# Altium schematic sheet MCU.SchDoc
size 320 x 193 mm
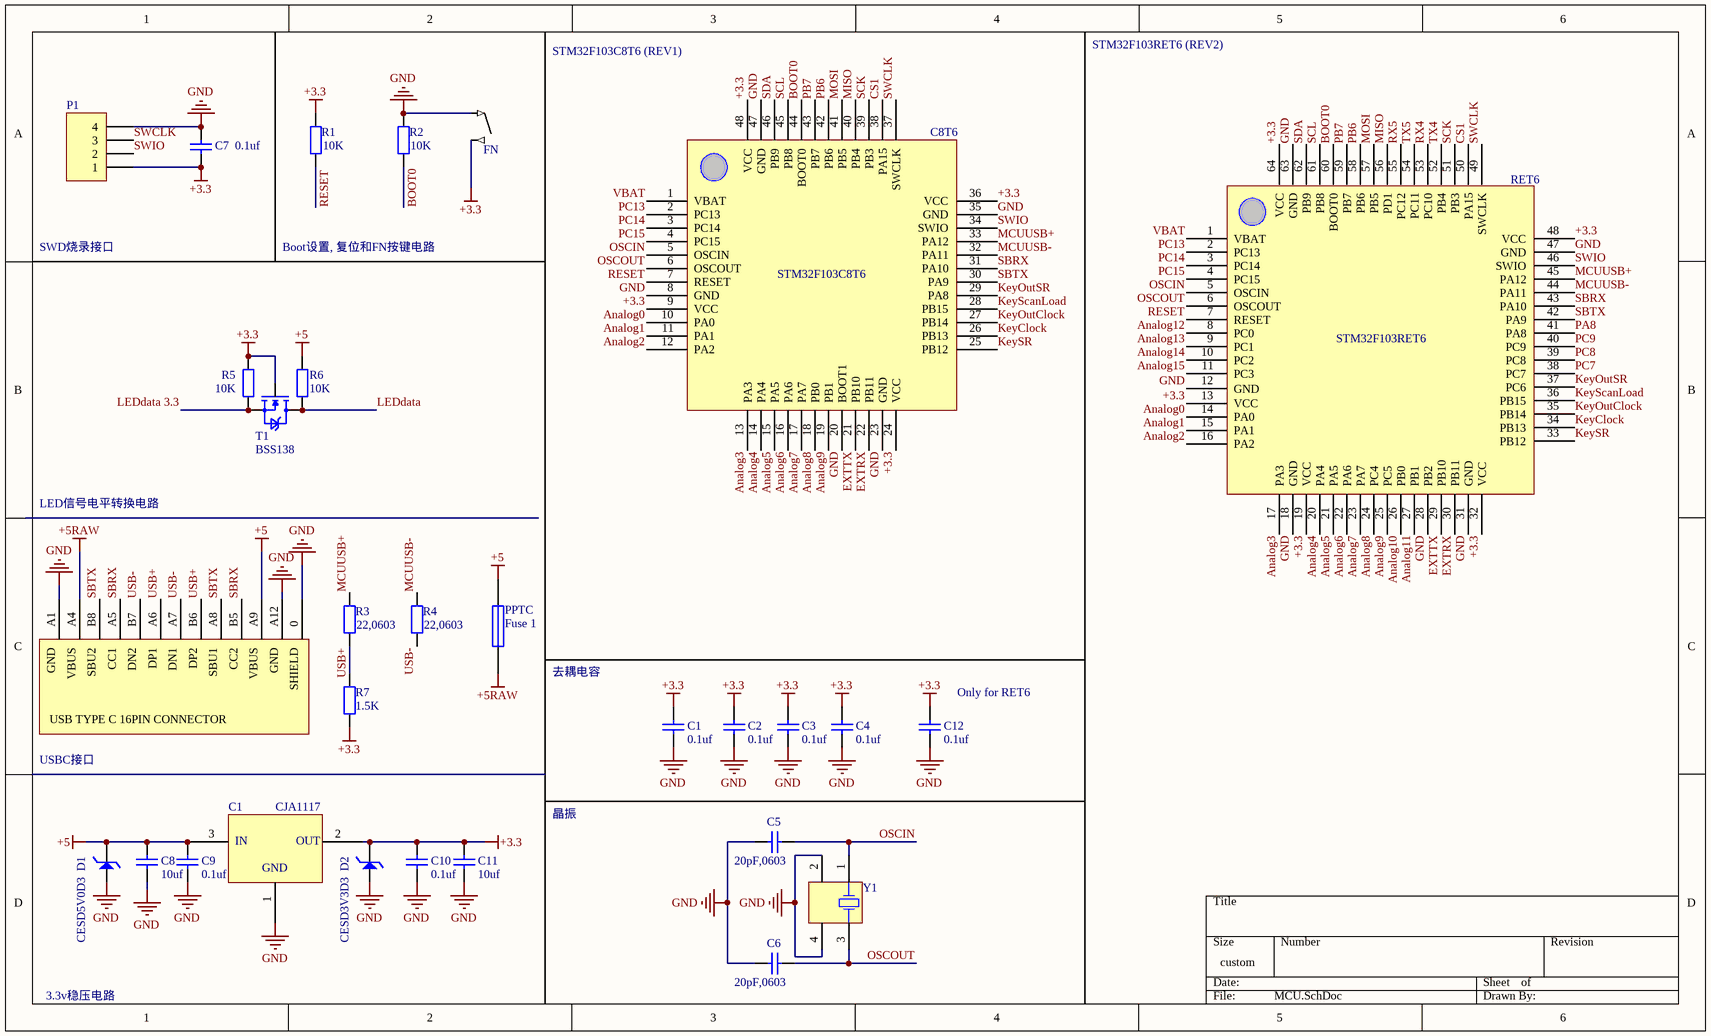
[diagram p0: MCU.SchDoc]

## Parts
(Parts that share a designator on the sheet are numbered #1, #2 ... from top to bottom, then left to right.)
1  System  [USBC 16PIN -1.6]  (value not drawn)
C1#1  value 0.1uf  [C1206]  (hidden comment: System)
C1#2  CJA1117  [SOT89-3L]
C2  value 0.1uf  [C1206]  (hidden comment: System)
C3  value 0.1uf  [C1206]  (hidden comment: System)
C4  value 0.1uf  [C1206]  (hidden comment: System)
C5  value 20pF,0603  [1608[0603]]  (hidden comment: System)
C6  value 20pF,0603  [1608[0603]]  (hidden comment: System)
C7  value 0.1uf  [C1206]  (hidden comment: System)
C8  value 10uf  [C1206]  (hidden comment: System)
C8T6  System  [STM-LQFP48_L]  (value not drawn)
C9  value 0.1uf  [C1206]  (hidden comment: System)
C10  value 0.1uf  [C1206]  (hidden comment: System)
C11  value 10uf  [C1206]  (hidden comment: System)
C12  value 0.1uf  [C1206]  (hidden comment: System)
D1  CESD5V0D3  [SOD323]
D2  CESD3V3D3  [SOD323]
FN  System  [dome button]  (value not drawn)
P1  System  [HDR1X4]  (value not drawn)
PPTC  Fuse 1  [C1206]
R1  value 10K  [C1206]  (hidden comment: System)
R2  value 10K  [C1206]  (hidden comment: System)
R3  value 22,0603  [1608[0603]]  (hidden comment: System)
R4  value 22,0603  [1608[0603]]  (hidden comment: System)
R5  value 10K  [C1206]  (hidden comment: System)
R6  value 10K  [C1206]  (hidden comment: System)
R7  value 1.5K  [C1206]  (hidden comment: System)
RET6  RET6  [STM-LQFP64_L]  (value not drawn)
T1  BSS138  [SOT23]
Y1  System  [3225]  (value not drawn)

## Nets
+3.3: C1#1.2 C1#2.2 C2.2 C3.2 C4.2 C7.1 C8T6.9(VCC) C8T6.24(VCC) C8T6.36(VCC) C8T6.48(VCC) C10.2 C11.2 C12.2 D2.2 FN.2(Out) P1.1 R1.2 R5.2 R7.2 RET6.13(VCC) RET6.19(VCC) RET6.32(VCC) RET6.48(VCC) RET6.64(VCC) T1.1
+5: 1.A9 C1#2.3 C8.2 C9.2 D1.2 PPTC.2 R6.2
+5RAW: 1.A4 PPTC.1
GND: 1.0 1.A1 1.A12 C1#1.1 C1#2.1 C2.1 C3.1 C4.1 C5.1 C6.1 C7.2 C8.1 C8T6.8(GND) C8T6.20(BOOT1) C8T6.23(GND) C8T6.35(GND) C8T6.47(GND) C9.1 C10.1 C11.1 C12.1 FN.1 P1.4 R2.2 RET6.12(GND) RET6.18(GND) RET6.28(PB2) RET6.31(GND) RET6.47(GND) RET6.63(GND) Y1.2(NC) Y1.4(NC)
Analog0: C8T6.10(PA0) RET6.14(PA0)
Analog1: C8T6.11(PA1) RET6.15(PA1)
Analog2: C8T6.12(PA2) RET6.16(PA2)
Analog3: C8T6.13(PA3) RET6.17(PA3)
Analog4: C8T6.14(PA4) RET6.20(PA4)
Analog5: C8T6.15(PA5) RET6.21(PA5)
Analog6: C8T6.16(PA6) RET6.22(PA6)
Analog7: C8T6.17(PA7) RET6.23(PA7)
Analog8: C8T6.18(PB0) RET6.24(PC4)
Analog9: C8T6.19(PB1) RET6.25(PC5)
Analog10: RET6.26(PB0)
Analog11: RET6.27(PB1)
Analog12: RET6.8(PC0)
Analog13: RET6.9(PC1)
Analog14: RET6.10(PC2)
Analog15: RET6.11(PC3)
BOOT0: C8T6.44(BOOT0) R2.1 RET6.60(BOOT0)
CS1: C8T6.38(PA15) RET6.50(PA15)
EXTRX: C8T6.22(PB11) RET6.30(PB11)
EXTTX: C8T6.21(PB10) RET6.29(PB10)
KeyClock: C8T6.26(PB13) RET6.34(PB13)
KeyOutClock: C8T6.27(PB14) RET6.35(PB14)
KeyOutSR: C8T6.29(PA8) RET6.37(PC6)
KeyScanLoad: C8T6.28(PB15) RET6.36(PB15)
KeySR: C8T6.25(PB12) RET6.33(PB12)
LEDdata: R6.1 T1.3
LEDdata 3.3: R5.1 T1.2
MCUUSB+: C8T6.33(PA12) R3.2 RET6.45(PA12)
MCUUSB-: C8T6.32(PA11) R4.2 RET6.44(PA11)
MISO: C8T6.40(PB4) RET6.56(PD1)
MOSI: C8T6.41(PB5) RET6.57(PB5)
OSCIN: C5.2 C8T6.5(OSCIN) RET6.5(OSCIN) Y1.1(OSC1)
OSCOUT: C6.2 C8T6.6(OSCOUT) RET6.6(OSCOUT) Y1.3(OSC2)
PA8: RET6.41(PA8)
PB6: C8T6.42(PB6) RET6.58(PB6)
PB7: C8T6.43(PB7) RET6.59(PB7)
PC7: RET6.38(PC7)
PC8: RET6.39(PC8)
PC9: RET6.40(PC9)
PC13: C8T6.2(PC13) RET6.2(PC13)
PC14: C8T6.3(PC14) RET6.3(PC14)
PC15: C8T6.4(PC15) RET6.4(PC15)
RESET: C8T6.7(RESET) R1.1 RET6.7(RESET)
RX4: RET6.53(PC10)
RX5: RET6.55(PC12)
SBRX: 1.A5 1.B5 C8T6.31(PA10) RET6.43(PA10)
SBTX: 1.A8 1.B8 C8T6.30(PA9) RET6.42(PA9)
SCK: C8T6.39(PB3) RET6.51(PB3)
SCL: C8T6.45(PB8) RET6.61(PB8)
SDA: C8T6.46(PB9) RET6.62(PB9)
SWCLK: C8T6.37(SWCLK) P1.3 RET6.49(SWCLK)
SWIO: C8T6.34(SWIO) P1.2 RET6.46(SWIO)
TX4: RET6.52(PB4)
TX5: RET6.54(PC11)
USB+: 1.A6 1.B6 R3.1 R7.1
USB-: 1.A7 1.B7 R4.1
VBAT: C8T6.1(VBAT) RET6.1(VBAT)

Not connected (* = marked no-connect by the designer): D1 1; D2 1

## Notes on the sheet
- STM32F103C8T6 (REV1)
- STM32F103RET6 (REV2)
- SWD烧录接口
- Boot设置, 复位和FN按键电路
- LED信号电平转换电路
- 去耦电容
- (near C12) Only for RET6
- USBC接口
- 晶振
- 3.3v稳压电路
- Labels drawn without touching a wire or pin: GND
- (in symbol C8T6) STM32F103C8T6
- (in symbol CJA1117) IN; OUT; GND
- (in symbol RET6) STM32F103RET6
- (in symbol USBC 16PIN) GND; VBUS; SBU2; CC1; DN2; DP1; DN1; DP2; SBU1; CC2; SHIELD; USB TYPE C 16PIN CONNECTOR

## Library data of the parts
1 = USBC 16PIN
C1#1 C2-C12 = Cap: Published: 8-Jun-2000; LatestRevisionDate: 17-Jul-2002; LatestRevisionNote: Re-released for DXP Platform.; PackageReference: RAD-0.3; Publisher: Altium Limited; PackageDescription: Radial Cap, Thru-Hole; 2 Leads; 0.3 in Pin Spacing
C8T6 = C8T6
D1 D2 = TVS
FN = SW
P1 = Header 4: LatestRevisionDate: 17-Jul-2002; LatestRevisionNote: Re-released for DXP Platform.; Publisher: Altium Limited
PPTC = Fuse 1: Fuse; Published: 8-Jun-2000; LatestRevisionDate: 17-Jul-2002; LatestRevisionNote: Re-released for DXP Platform.; PackageReference: PIN-W2/E2.8; Publisher: Altium Limited; PackageDescription: Thru-Hole; 2 Leads
R1-R7 = Res2: Published: 8-Jun-2000; LatestRevisionDate: 17-Jul-2002; LatestRevisionNote: Re-released for DXP Platform.; PackageReference: AXIAL-0.4; Publisher: Altium Limited; PackageDescription: Axial Device, Thru-Hole; 2 Leads; 0.4 in Pin Spacing
Y1 = 3225Crystal